# Altium schematic sheet Sheet_V01.SchDoc
size A3
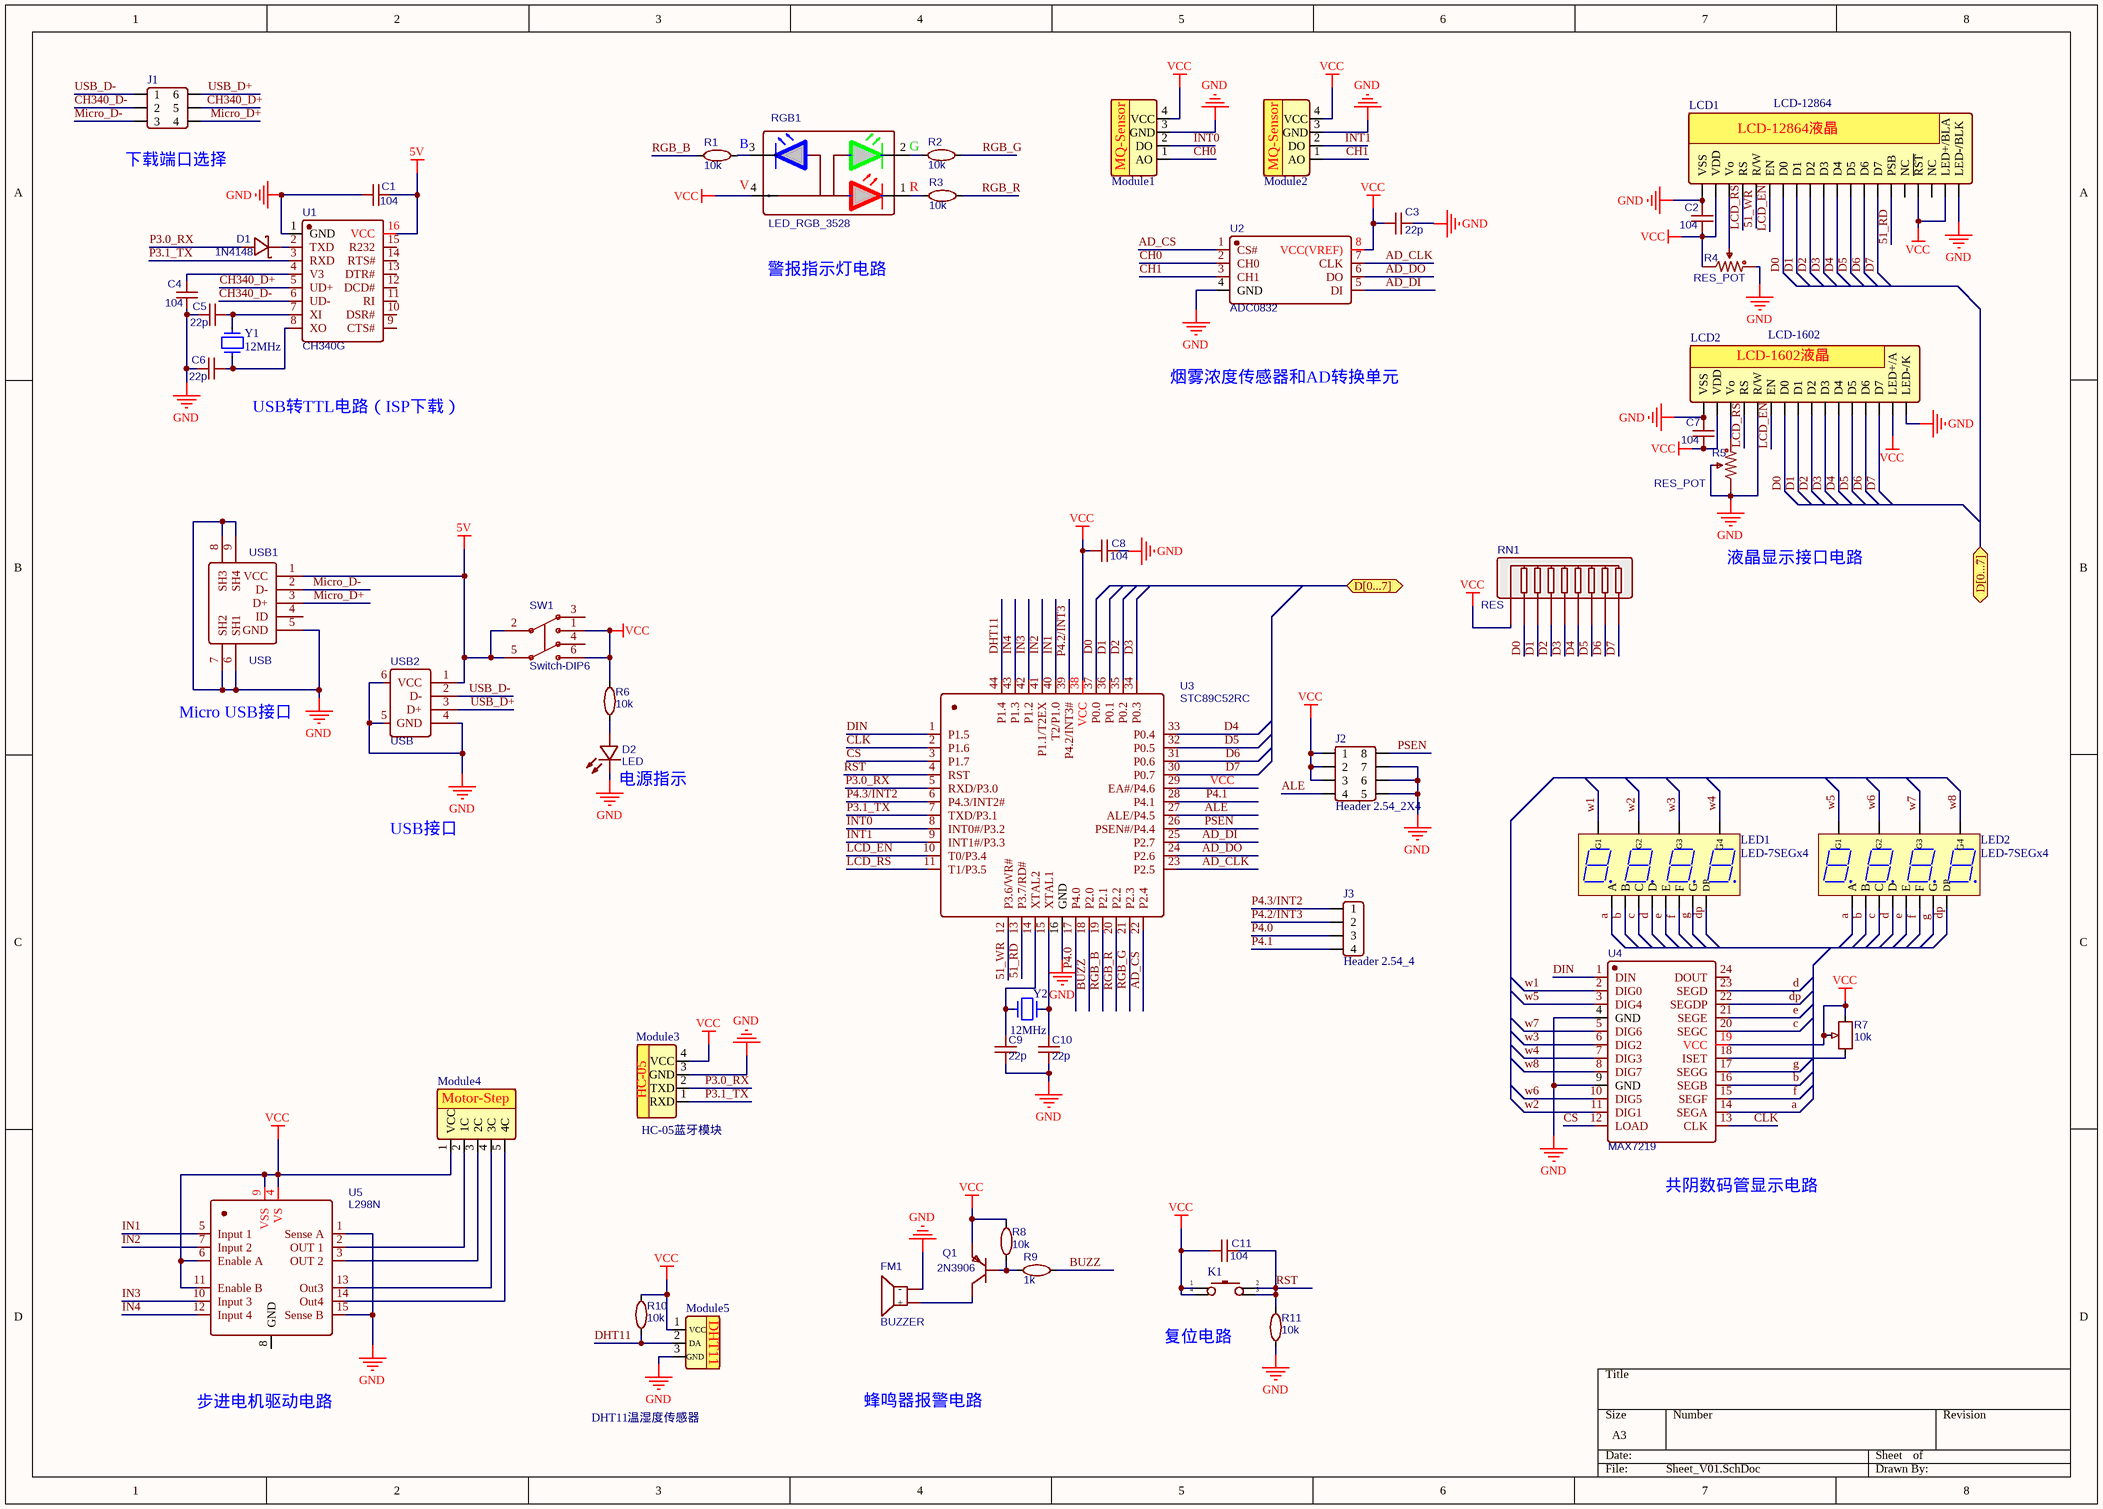
[diagram p0: Sheet_V01.SchDoc]

## Parts
C1  104  [CAP_0805]
C2  104  [CAP_0805]
C3  22p  [CAP_0805]
C4  104  [CAP_0805]
C5  22p  [CAP_0805]
C6  22p  [CAP_0805]
C7  104  [CAP_0805]
C8  104  [CAP_0805]
C9  22p  [CAP_0805]
C10  22p  [CAP_0805]
C11  104  [CAP_0805]
D1  1N4148  [SOD-123_1206]
D2  LED  [LED_0805_R]
FM1  BUZZER  [BUZZ-12*7.5]
J1  Header 2.54_2X3  [Header 2.54_2X3]  (value not drawn)
J2  Header 2.54_2X4  [Header 2.54_2X4]
J3  Header 2.54_4  [Header 2.54X4]
K1  DIP-Button_4P  [TSW DIP-6*6*6]  (value not drawn)
LCD1  LCD-12864  [Header F 2.54X20]
LCD2  LCD-1602  [Header F 2.54X16]
LED1  LED-7SEGx4  [DISP_0.56_4]
LED2  LED-7SEGx4  [DISP_0.56_4]
Module1  MQ-2烟雾浓度传感器  [Header F 2.54X4]  (value not drawn)
Module2  MQ-2烟雾浓度传感器  [Header F 2.54X4]  (value not drawn)
Module3  HC-05蓝牙模块  [Header F 2.54X4]
Module4  5线4相步进电机  [XH_2.54_5P]  (value not drawn)
Module5  DHT11温湿度传感器  [Header F 2.54X3]
Q1  2N3906  [TO_92A]
R1  10k  [RES_0805]
R2  10k  [RES_0805]
R3  10k  [RES_0805]
R4  RES_POT  [RES_POT-3362P]
R5  RES_POT  [RES_POT-3362P]
R6  10k  [RES_0805]
R7  10k  [RES_POT-3296W]
R8  10k  [RES_0805]
R9  1k  [RES_0805]
R10  10k  [RES_0805]
R11  10k  [RES_0805]
RGB1  LED_RGB_3528  [LED_3528_RGB]
RN1  RES  [RES_8P]
SW1  Switch-DIP6  [Switch_6]
U1  CH340G  [SOP-16]
U2  ADC0832  [DIP_8]
U3  STC89C52RC  [LQFP_44_10X10]
U4  MAX7219  [DIP_24]
U5  L298N  [Multiwatt_15]
USB1  USB  [USB_Micro_DIP2]
USB2  USB  [USB-A-TH]
Y1  12MHz  [XTAL1]
Y2  12MHz  [XTAL1]

## Ports
D[0...7]

## Nets
5V: C1.2 SW1.2(C) SW1.5(C) U1.16(VCC) USB1.1(VCC) USB2.1(VCC)
GND: C1.1 C2.2 C3.2 C4.1 C5.1 C6.1 C7.2 C8.2 C9.2 C10.2 D2.C FM1.2(－) J2.5 J2.6 J2.7 LCD1.1(VSS) LCD1.20(LED-/BLK) LCD2.1(VSS) LCD2.5(R/W) LCD2.16(LED-/K) Module1.3(GND) Module2.3(GND) Module3.3(GND) Module5.3(GND) R4.3 R5.1 R5.2 R11.2 U1.1(GND) U2.4(GND) U3.16(GND) U4.4(GND) U4.9(GND) U5.1(Sense_A) U5.15(Sense_B) USB1.5(GND) USB1.6(SH1) USB1.7(SH2) USB1.8(SH3) USB1.9(SH4) USB2.4(GND) USB2.5(SH4) USB2.6(SH1)
VCC: C2.1 C3.1 C7.1 C8.1 C11.1 J2.1 J2.2 J2.3 K1.1 K1.4 LCD1.2(VDD) LCD1.17(~{RST}) LCD1.19(LED+/BLA) LCD2.2(VDD) LCD2.15(LED+/A) Module1.4(VCC) Module2.4(VCC) Module3.4(VCC) Module4.1(VCC) Module5.1(VCC) Q1.1(E) R4.1 R6.1 R7.2 R7.3 R8.1 R10.1 RGB1.4 RN1.1 SW1.1(ON) SW1.6(ON) U2.8(VCC(VREF)) U3.29(EA#/P4.6) U3.38(VCC) U4.19(VCC) U5.4(VS) U5.6(Enable_A) U5.9(VSS) U5.11(Enable_B)
51_RD: LCD1.15(PSB) U3.13(P3.7/RD#)
51_WR: LCD1.5(R/W) U3.12(P3.6/WR#)
a: LED1.11(A) LED2.11(A) U4.14(SEGA)
AD_CLK: U2.7(CLK) U3.23(P2.5)
AD_CS: U2.1(CS#) U3.22(P2.4)
AD_DI: U2.5(DI) U3.25(P2.7)
AD_DO: U2.6(DO) U3.24(P2.6)
ALE: J2.4 U3.27(ALE/P4.5)
b: LED1.7(B) LED2.7(B) U4.16(SEGB)
BUZZ: R9.1 U3.18(P2.0)
c: LED1.4(C) LED2.4(C) U4.20(SEGC)
CH0: Module1.1(AO) U2.2(CH0)
CH1: Module2.1(AO) U2.3(CH1)
CH340_D+: J1.5 U1.5(UD+)
CH340_D-: J1.2 U1.6(UD-)
CLK: U3.2(P1.6) U4.13(CLK)
CS: U3.3(P1.7) U4.12(LOAD)
d: LED1.2(D) LED2.2(D) U4.23(SEGD)
D0: LCD1.7(D0) LCD2.7(D0) RN1.2 U3.37(P0.0)
D1: LCD1.8(D1) LCD2.8(D1) RN1.3 U3.36(P0.1)
D2: LCD1.9(D2) LCD2.9(D2) RN1.4 U3.35(P0.2)
D3: LCD1.10(D3) LCD2.10(D3) RN1.5 U3.34(P0.3)
D4: LCD1.11(D4) LCD2.11(D4) RN1.6 U3.33(P0.4)
D5: LCD1.12(D5) LCD2.12(D5) RN1.7 U3.32(P0.5)
D6: LCD1.13(D6) LCD2.13(D6) RN1.8 U3.31(P0.6)
D7: LCD1.14(D7) LCD2.14(D7) RN1.9 U3.30(P0.7)
DHT11: Module5.2(DA) R10.2 U3.44(P1.4)
DIN: U3.1(P1.5) U4.1(DIN)
dp: LED1.3(DP) LED2.3(DP) U4.22(SEGDP)
e: LED1.1(E) LED2.1(E) U4.21(SEGE)
f: LED1.10(F) LED2.10(F) U4.15(SEGF)
g: LED1.5(G) LED2.5(G) U4.17(SEGG)
IN1: U3.40(T2/P1.0) U5.5(Input_1)
IN2: U3.41(P1.1/T2EX) U5.7(Input_2)
IN3: U3.42(P1.2) U5.10(Input_3)
IN4: U3.43(P1.3) U5.12(Input_4)
INT0: Module1.2(DO) U3.8(INT0#/P3.2)
INT1: Module2.2(DO) U3.9(INT1#/P3.3)
LCD_EN: LCD1.6(EN) LCD2.6(EN) U3.10(T0/P3.4)
LCD_RS: LCD1.4(RS) LCD2.4(RS) U3.11(T1/P3.5)
Micro_D+: J1.4 USB1.3(D+)
Micro_D-: J1.3 USB1.2(D-)
P3.0_RX: D1.1(A) Module3.2(TXD) U3.5(RXD/P3.0)
P3.1_TX: Module3.1(RXD) U1.3(RXD) U3.7(TXD/P3.1)
P4.0: J3.3 U3.17(P4.0)
P4.1: J3.4 U3.28(P4.1)
P4.2/INT3: J3.2 U3.39(P4.2/INT3#)
P4.3/INT2: J3.1 U3.6(P4.3/INT2#)
PSEN: J2.8 U3.26(PSEN#/P4.4)
RGB_B: R1.1 U3.19(P2.1)
RGB_G: R2.2 U3.21(P2.3)
RGB_R: R3.2 U3.20(P2.2)
RST: C11.2 K1.2 K1.3 R11.1 U3.4(RST)
USB_D+: J1.6 USB2.3(D+)
USB_D-: J1.1 USB2.2(D-)
w1: LED1.12(G1) U4.2(DIG0)
w2: LED1.9(G2) U4.11(DIG1)
w3: LED1.8(G3) U4.6(DIG2)
w4: LED1.6(G4) U4.7(DIG3)
w5: LED2.12(G1) U4.3(DIG4)
w6: LED2.9(G2) U4.10(DIG5)
w7: LED2.8(G3) U4.5(DIG6)
w8: LED2.6(G4) U4.8(DIG7)
NetC4_2: C4.2 U1.4(V3)
NetC5_2: C5.2 U1.7(XI) Y1.2
NetC6_2: C6.2 U1.8(XO) Y1.1
NetC9_1: C9.1 U3.14(XTAL2) Y2.1
NetC10_1: C10.1 U3.15(XTAL1) Y2.2
NetD1_2: D1.2(C) U1.2(TXD)
NetD2_A: D2.A R6.2
NetFM1_1: FM1.1(+) Q1.3(C)
NetLCD1_3: LCD1.3(Vo) R4.2
NetLCD2_3: LCD2.3(Vo) R5.3
NetModule4_2: Module4.2(1C) U5.2(OUT_1)
NetModule4_3: Module4.3(2C) U5.3(OUT_2)
NetModule4_4: Module4.4(3C) U5.13(Out3)
NetModule4_5: Module4.5(4C) U5.14(Out4)
NetQ1_2: Q1.2(B) R8.2 R9.2
NetR1_2: R1.2 RGB1.3
NetR2_1: R2.1 RGB1.2
NetR3_1: R3.1 RGB1.1
NetR7_1: R7.1 U4.18(ISET)

Not connected (* = marked no-connect by the designer): LCD1 16(NC) 18(NC); SW1 3(NC) 4(NC); U1 9(CTS#) 10(DSR#) 11(RI) 12(DCD#) 13(DTR#) 14(RTS#) 15(R232); U4 24(DOUT); U5 8(GND); USB1 4(ID)

## Notes on the sheet
- (near J1) 下载端口选择
- 警报指示灯电路
- 烟雾浓度传感器和AD转换单元
- USB转TTL电路（ISP下载）
- 液晶显示接口电路
- Micro USB接口
- (near D2) 电源指示
- USB接口
- (near U4) 共阴数码管显示电路
- (near K1) 复位电路
- 步进电机驱动电路
- 蜂鸣器报警电路
- (in symbol 5线4相步进电机) Motor-Step
- (in symbol DHT11温湿度传感器) DHT11
- (in symbol HC-05蓝牙模块) HC-05
- (in symbol LED_RGB_3528) B; G; V; R
- (in symbol MQ-2烟雾浓度传感器) MQ-Sensor

## Library data of the parts
C1-C11 = CAP_0805: BOM_Manufacturer: Samsung Electro-Mechanics; BOM_Manufacturer Part: CL10B104KB8WPNC; nameAlias: Capacitance; Contributor: LCSC; BOM_Supplier: LCSC; BOM_Supplier Part: C307348; spicePre: C; spiceSymbolName: CL10B104KB8WPNC
D1 = 1N4148: BOM_Manufacturer: KEXIN; BOM_Manufacturer Part: 1N5819; Contributor: LCSC; BOM_Supplier: LCSC; BOM_Supplier Part: C437199; spicePre: D; spiceSymbolName: 1N5819_C437199
D2 = LED_0805: 发光LED; BOM_Manufacturer: ARKLED; BOM_Manufacturer Part: D-G080508G1; Contributor: LCSC; BOM_Supplier: LCSC; BOM_Supplier Part: C107402; spicePre: L; spiceSymbolName: D-G080508G1
FM1 = BUZZER: 蜂鸣器; BOM_Manufacturer: HNDZ; BOM_Manufacturer Part: TMB12A12; BOM_Supplier: LCSC; BOM_Supplier Part: C96079; spicePre: B; spiceSymbolName: TMB12A12
K1 = DIP-Button_4P: 按键，直插，6*6*6
LCD1 = LCD-12864液晶
LCD2 = LCD-1602液晶
Q1 = 2N3906: 三极管PNP; BOM_Manufacturer: BLUE ROCKET; Contributor: LCSC; BOM_Supplier: LCSC; BOM_Supplier Part: C305396; BOM_Manufacturer Part: 2N3906; spicePre: Q; spiceSymbolName: 2N3906_C305396
R1-R3 R6 R8-R11 = RES_0805: BOM_Manufacturer: YAGEO; BOM_Manufacturer Part: RC0402JR-07100KL; nameAlias: Resistance (Ohms); BOM_Supplier: LCSC; BOM_Supplier Part: C106234; spicePre: R; spiceSymbolName: RC0402JR-07100KL
R4 R5 = RES_POT-3362P: 可调电阻3362P; BOM_Manufacturer: Chengdu Guosheng Tech; BOM_Manufacturer Part: 3362P-1-102; Resistance(Ohms): 1K; nameAlias: Resistance (Ohms); Contributor: LCSC; BOM_Supplier: LCSC; BOM_Supplier Part: C118947; spicePre: R; spiceSymbolName: 3362P-1-102
R7 = RES_POT-3296W: 可调电阻3296W; BOM_Manufacturer: Chengdu Guosheng Tech; BOM_Manufacturer Part: 3296W-1-104; Resistance(Ohms): 100K; nameAlias: Resistance (Ohms); Contributor: LCSC; BOM_Supplier: LCSC; BOM_Supplier Part: C118963; spicePre: R; spiceSymbolName: 3296W-1-104
RGB1 = LED_RGB_3528: BOM_Manufacturer: NATIONSTAR; BOM_Manufacturer Part: FM-3528RGBA-HF; Contributor: LCSC; BOM_Supplier: LCSC; BOM_Supplier Part: C108539; spicePre: L; spiceSymbolName: FM-3528RGBA-HF
RN1 = RES-8-DIP: 直插排阻; BOM_Manufacturer: FH; BOM_Manufacturer Part: A09-511J; BOM_Supplier: LCSC; BOM_Supplier Part: C88134; spicePre: R; spiceSymbolName: A09-511J
SW1 = Switch-DIP6: 6脚自锁开关; BOM_Manufacturer: PANASONIC; BOM_Manufacturer Part: ESB33535; BOM_Supplier: LCSC; BOM_Supplier Part: C79134; spicePre: S; spiceSymbolName: ESB33535
U1 = CH340G: BOM_Manufacturer: WCH; SMT Type: Basic; timeStamp: 1468327462; BOM_Supplier: LCSC; BOM_Manufacturer Part: CH340G; BOM_LCSC Assembly: Yes; image: //image.lceda.cn/szlcsc/C14267.jpg; BOM_Supplier Part: C14267; spicePre: U; spiceSymbolName: CH340G
U2 = ADC0832: BOM_Manufacturer: Texas Instruments; BOM_Manufacturer Part: ADC0832CCN/NOPB; Contributor: LCSC; BOM_Supplier: LCSC; BOM_Supplier Part: C385862; spicePre: U; spiceSymbolName: ADC0832CCN/NOPB
U3 = STC89C52RC_SMD: BOM_Manufacturer: STC; BOM_Manufacturer Part: STC89C52RC-40I; SMT Type: Basic; BOM_Supplier: LCSC; BOM_LCSC Assembly: Yes; BOM_Supplier Part: C8707; spicePre: U; spiceSymbolName: STC89C52RC-40I_C8707
U4 = MAX7219: BOM_Manufacturer: MAXIM; BOM_Manufacturer Part: max7219cng; spicePre: X; BOM_Supplier: LCSC; image: //image.lceda.cn/szlcsc/C29160.jpg; BOM_Supplier Part: C29160; spiceSymbolName: max7219cng
U5 = L298N: BOM_Manufacturer: HGSEMI; Contributor: LCSC; BOM_Supplier: LCSC; BOM_Supplier Part: C434589; BOM_Manufacturer Part: L298N; spicePre: U; spiceSymbolName: L298N
USB1 = MicroUSB: BOM_Manufacturer: SHOU HAN; BOM_Manufacturer Part: MicroXNJ; Contributor: LCSC; BOM_Supplier: LCSC; BOM_Supplier Part: C404969; spicePre: U; spiceSymbolName: MICROXNJ
USB2 = USBA: BOM_Manufacturer: SHOU HAN; BOM_Manufacturer Part: MicroXNJ; Contributor: LCSC; BOM_Supplier: LCSC; BOM_Supplier Part: C404969; spicePre: U; spiceSymbolName: MICROXNJ
Y1 Y2 = XTAL-2: 晶振